# EAGLE design controller11lcd (EAGLE 8.3.1)

## Sheet 1 of 2
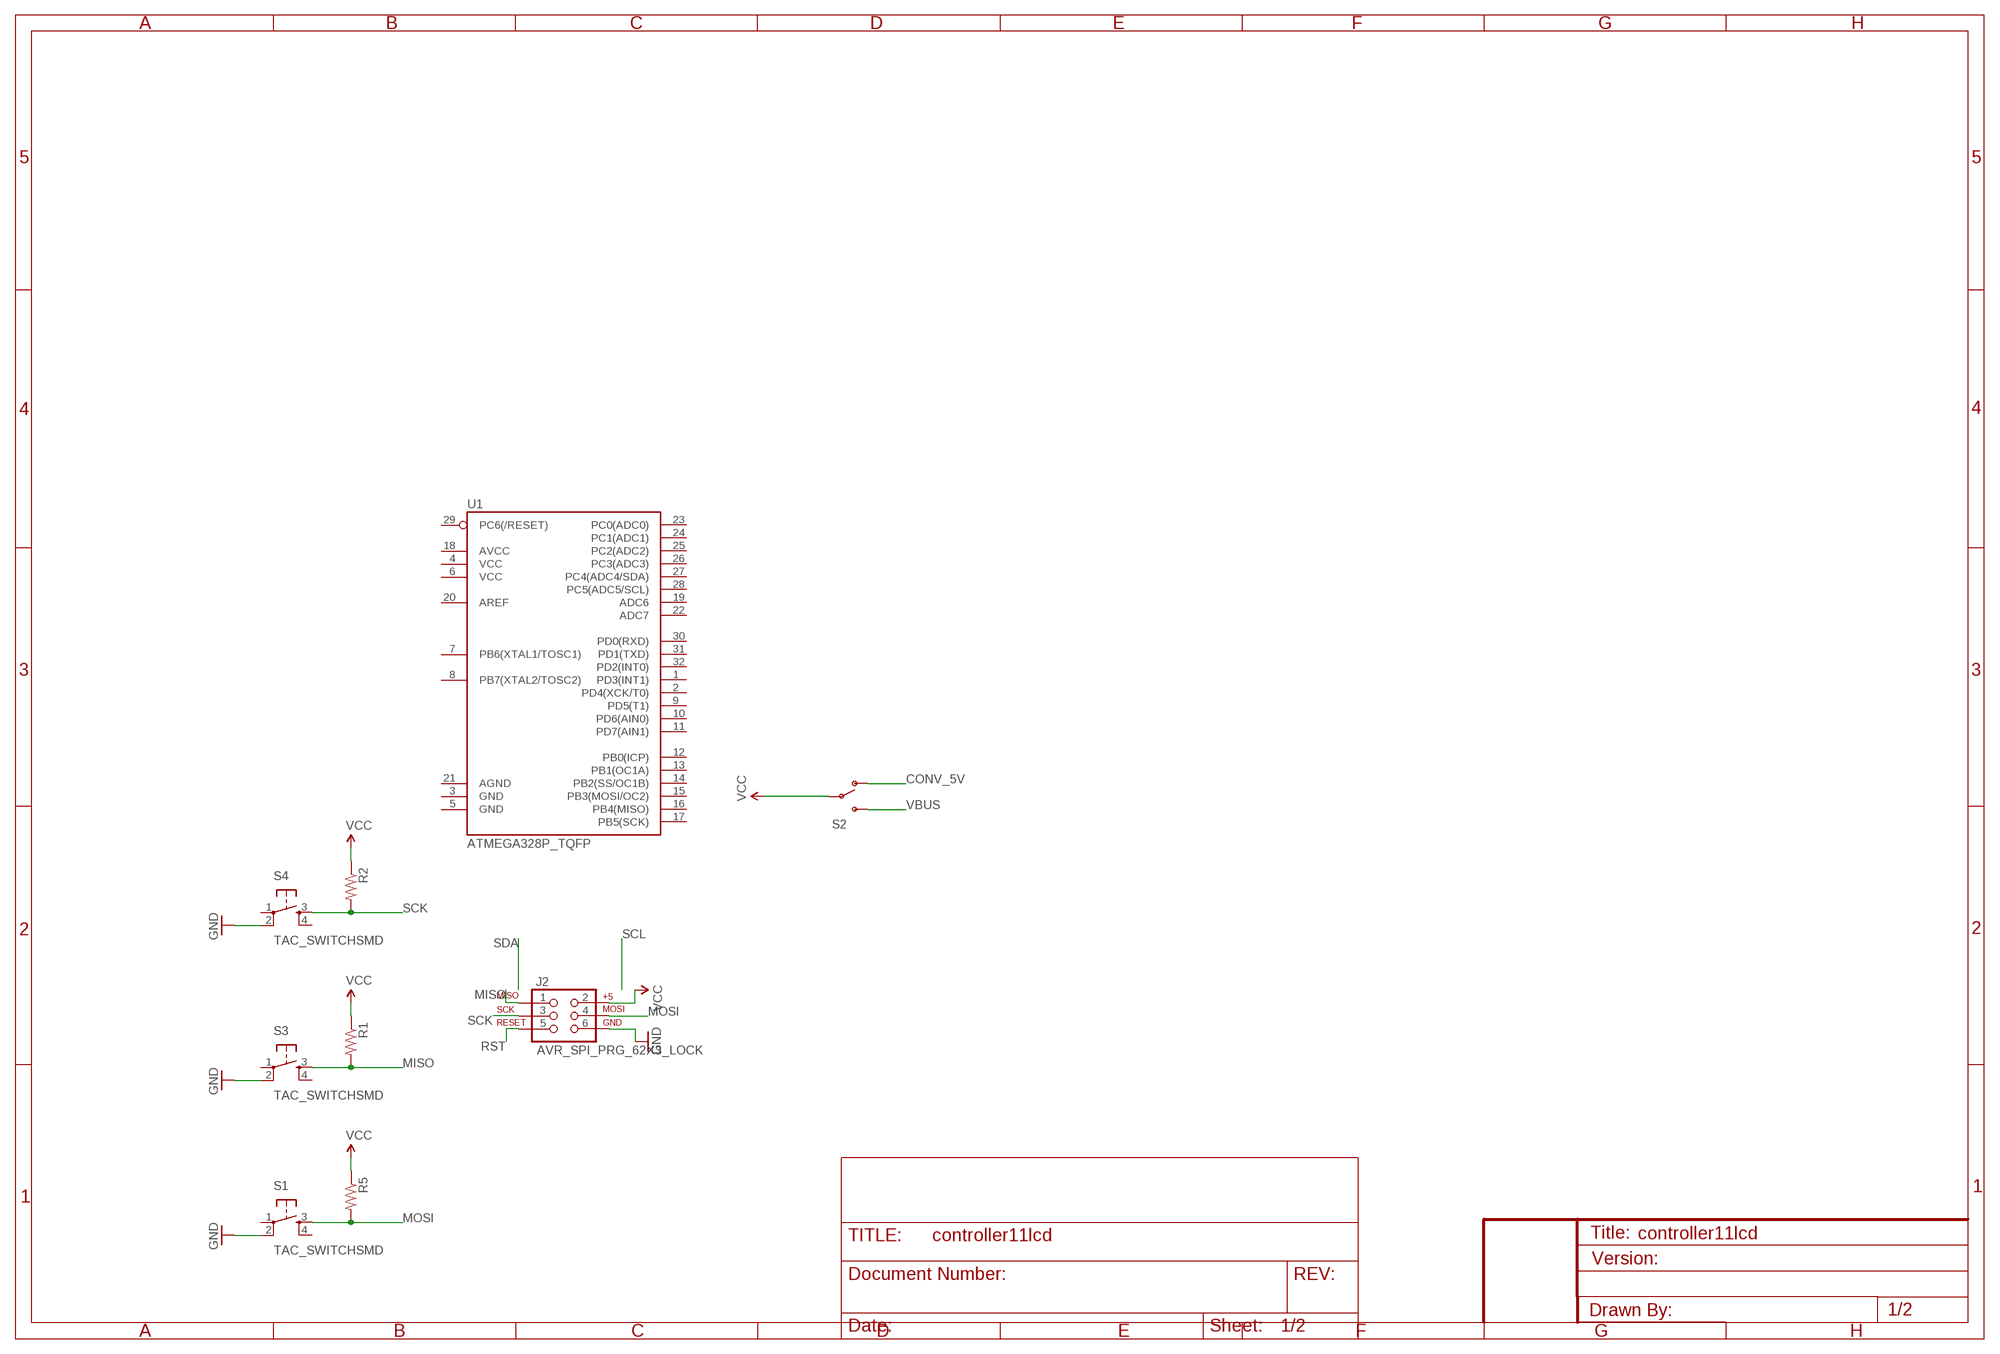
[diagram p0: schematic, sheet 1]

### Parts
J2  AVR_SPI_PRG_62X3_LOCK  [2X3_LOCK]
R1  RESISTOR1206  [1206]
R2  RESISTOR1206  [1206]
R5  RESISTOR1206  [1206]
S1  TAC_SWITCHSMD  TAC_SWITCHPTH  [TACTILE-PTH]
S2  SWITCH-SPDTSMD2  [SWITCH-SPDT-SMD]
S3  TAC_SWITCHSMD  TAC_SWITCHPTH  [TACTILE-PTH]
S4  TAC_SWITCHSMD  TAC_SWITCHPTH  [TACTILE-PTH]
U1  ATMEGA328P_TQFP  [TQFP32-08]

### Nets
CONV_5V [power]: S2.1(O)
GND: J2.6 S1.2 S3.2 S4.2
MISO: J2.1 R1.2 S3.3
MOSI: J2.4 R5.2 S1.3
RST: J2.5
SCK: J2.3 R2.2 S4.3
VBUS: S2.3(S)
VCC [power]: J2.2 R1.1 R2.1 R5.1 S2.2(P)
Unconnected: S1.1 S1.4 S3.1 S3.4 S4.1 S4.4 U1.1(PD3(INT1)) U1.2(PD4(XCK/T0)) U1.3(GND) U1.4(VCC) U1.5(GND) U1.6(VCC) U1.7(PB6(XTAL1/TOSC1)) U1.8(PB7(XTAL2/TOSC2)) U1.9(PD5(T1)) U1.10(PD6(AIN0)) U1.11(PD7(AIN1)) U1.12(PB0(ICP)) U1.13(PB1(OC1A)) U1.14(PB2(SS/OC1B)) U1.15(PB3(MOSI/OC2)) U1.16(PB4(MISO)) U1.17(PB5(SCK)) U1.18(AVCC) U1.19(ADC6) U1.20(AREF) U1.21(AGND) U1.22(ADC7) U1.23(PC0(ADC0)) U1.24(PC1(ADC1)) U1.25(PC2(ADC2)) U1.26(PC3(ADC3)) U1.27(PC4(ADC4/SDA)) U1.28(PC5(ADC5/SCL)) U1.29(PC6(/RESET)) U1.30(PD0(RXD)) U1.31(PD1(TXD)) U1.32(PD2(INT0))

## Sheet 2 of 2
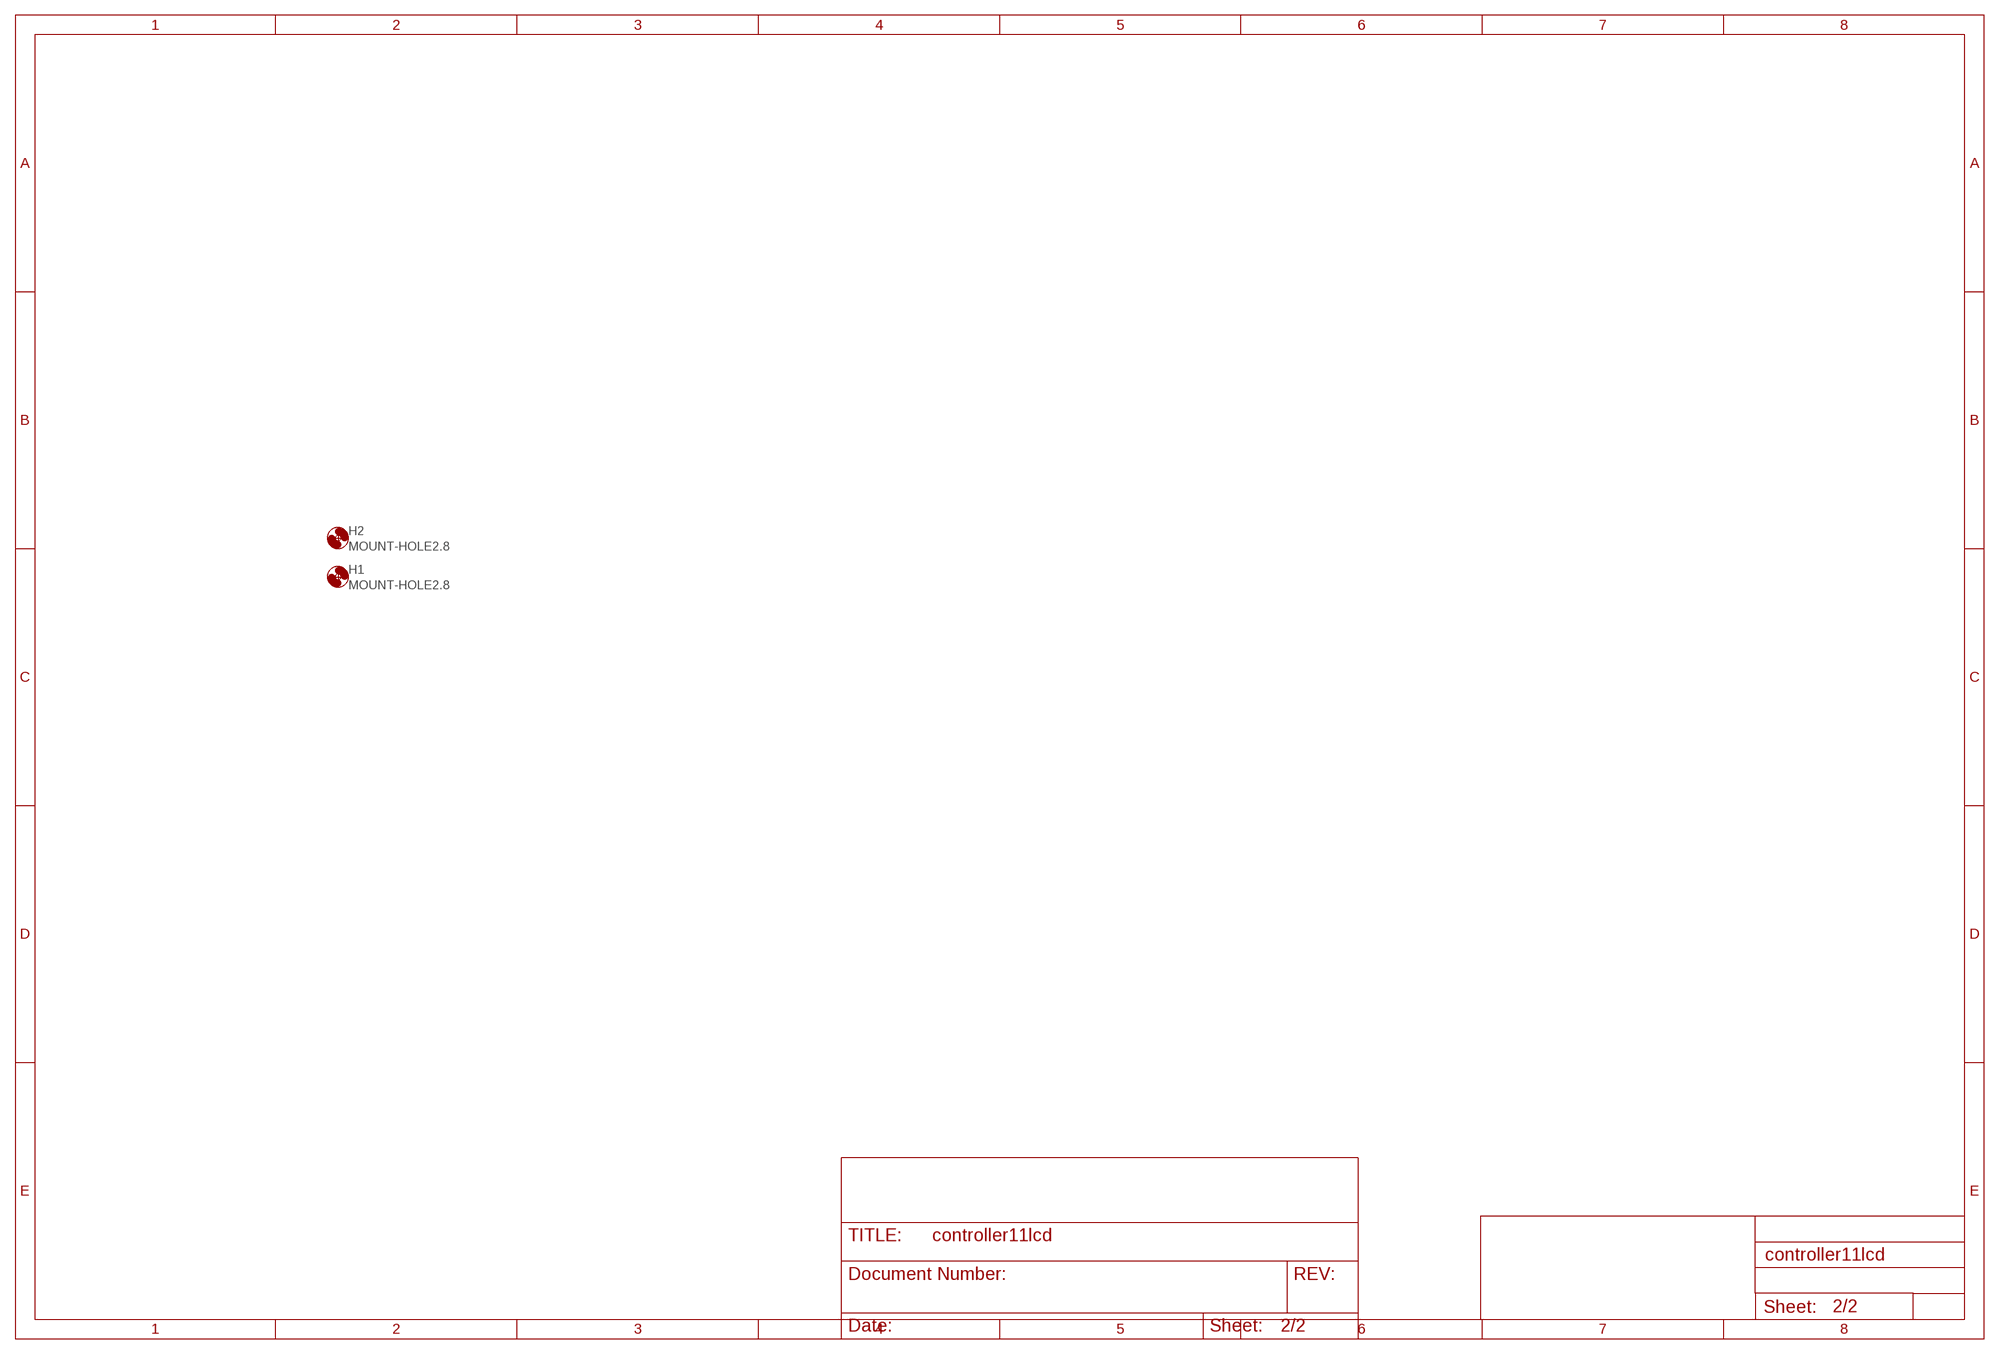
[diagram p1: schematic, sheet 2]

### Parts
H1  MOUNT-HOLE2.8  [2,8]
H2  MOUNT-HOLE2.8  [2,8]

## Library data of the parts
H1 H2 = holes:MOUNT-HOLE: MOUNTING HOLE with drill center marker
J2 = SparkFun-Connectors:AVR_SPI_PRG_6: AVR ISP 6 Pin This is the reduced ISP connector for AVR programming. Common on Arduino. This footprint will take up less PCB space and can be used with a 10-pin to 6-pin adapter such as SKU: BOB-08508 **Special note about "TEST_POINT" package. The stop mask is on the top side, so if you want your programming test points to be on the bottom of your board, make sure to place this package on the bottom side of the board. This also ensure that the orientation to program from the bottom side will be correct.
R1 R2 R5 = SparkFun-Passives:RESISTOR: Resistor Basic schematic elements and footprints for 0603, 1206, and PTH resistors.
S1 S3 S4 = SparkFun-Retired:TAC_SWITCH: Momentary Switch Button commonly used for reset or general input. Spark Fun Electronics SKU : COM-00097 SMT- SWCH-08247
S2 = SparkFun-Electromechanical:SWITCH-SPDT: SPDT Switch Simple slide switch, Spark Fun Electronics SKU : COM-00102 DPDT SMT slide switch, AYZ0202, SWCH-08179
U1 = SparkFun-DigitalIC:ATMEGA328P_TQFP; PROD_ID: IC-09069

## Net classes
0 default: width 0.254 mm, clearance 0.254 mm
1 power: width 0.381 mm, clearance 0.254 mm
2 camera_power: width 0.66 mm, clearance 0.254 mm
3 usbsignal: width 0.254 mm, clearance 0.203 mm

## Board
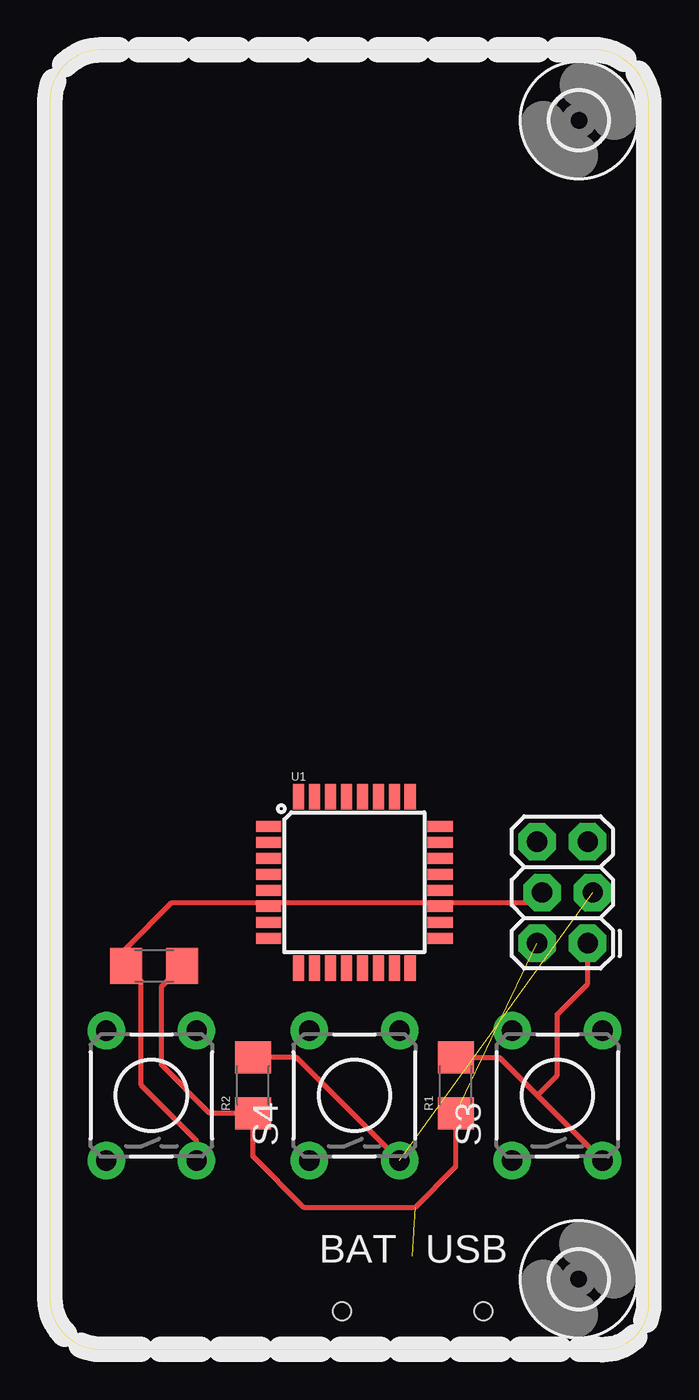
[diagram p2: board, top side]
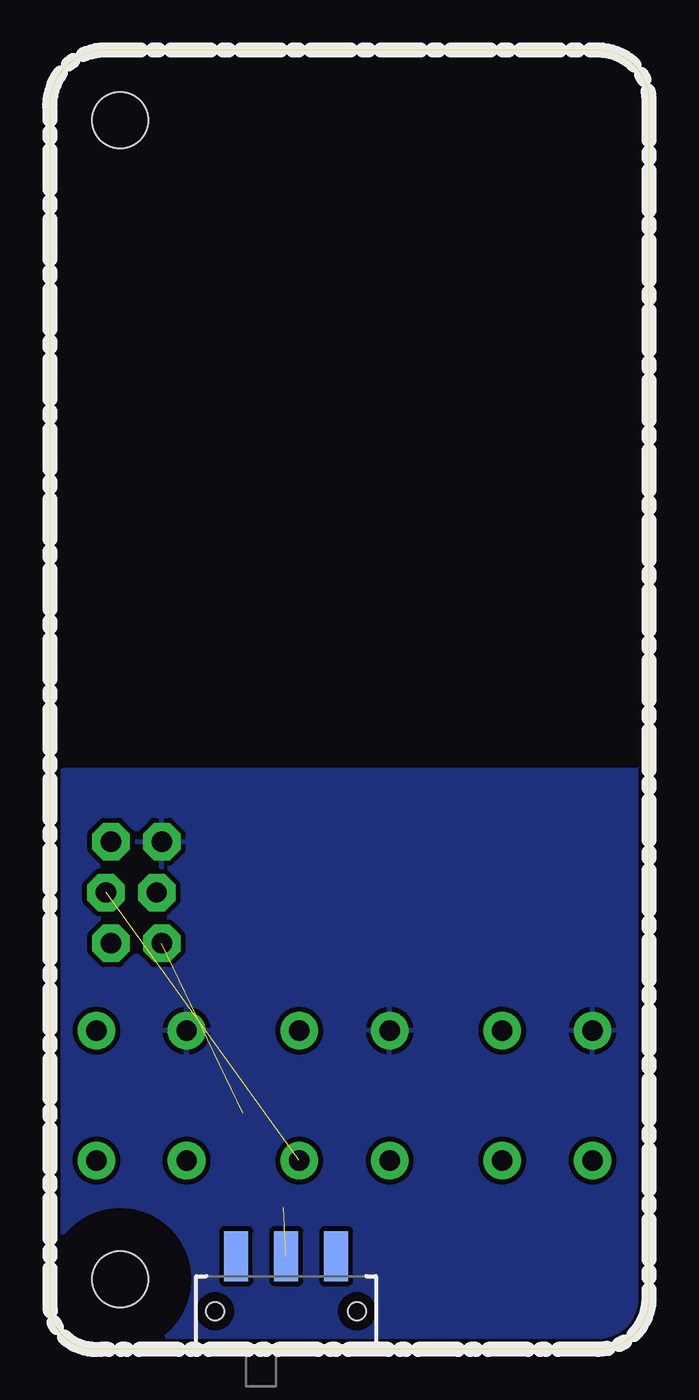
[diagram p3: board, bottom side, seen from below]

Size 29.98 x 65.04 mm. Coordinates in mm from the lower left corner, seen from the top.
Outline: 0,2.55 arc90 2.54,0.01 27.43,0.01 arc90 29.97,2.05 29.97,61.99 arc90 27.43,65.04 2.54,65.04 arc90 0,62.5 0,2.55
Copper layers (1*16): Top 0.035mm / dielectric 1.5mm / Bottom 0.035mm
Design rules "default *": minimum track width 10mil, minimum drill 24mil, track to track 8mil, track to pad 8mil, pad to pad 8mil, via to via 8mil, smd to smd 8mil, copper to edge 20mil, drill to drill 8mil, minimum pad ring 10mil, minimum via ring 8mil, stop-mask expansion 4mil, vias tented up to drill 0mil, thermal gap 10mil

### Footprints (pad centres in the part's own frame; a part is rotated, then mirrored left to right if it is on the bottom)
2,8 = hole 2.8: 0,0
2X3_LOCK = drill 1.016 pad 1.88 octagon: 1 0,0; 2 0,2.54; 3 2.54,-0.254; 4 2.54,2.286; 5 5.08,0; 6 5.08,2.54
1206 = smd 1.6 x 1.8: 1 -1.4,0; 2 1.4,0
TACTILE-PTH = drill 1.016 pad 1.88: 1 -3.251,2.261; 2 3.251,2.261; 3 -3.251,-2.261; 4 3.251,-2.261
SWITCH-SPDT-SMD = smd 1.2 x 2.5: 1 -2.5,-2.75; 2 0,-2.75; 3 2.5,-2.75 | hole 0.9: -3.55,0; 3.55,0
TQFP32-08 = smd 1.27 x 0.559: 1 -4.293,2.8; 2 -4.293,2; 3 -4.293,1.2; 4 -4.293,0.4; 5 -4.293,-0.4; 6 -4.293,-1.2; 7 -4.293,-2; 8 -4.293,-2.8; 17 4.293,-2.8; 18 4.293,-2; 19 4.293,-1.2; 20 4.293,-0.4; 21 4.293,0.4; 22 4.293,1.2; 23 4.293,2; 24 4.293,2.8 | smd 0.559 x 1.27: 9 -2.8,-4.293; 10 -2,-4.293; 11 -1.2,-4.293; 12 -0.4,-4.293; 13 0.4,-4.293; 14 1.2,-4.293; 15 2,-4.293; 16 2.8,-4.293; 25 2.8,4.293; 26 2,4.293; 27 1.2,4.293; 28 0.4,4.293; 29 -0.4,4.293; 30 -1.2,4.293; 31 -2,4.293; 32 -2.8,4.293

### Placement (x,y rotation side)
H1  26.47,3.52 0 top
H2  26.48,61.52 0 top
J2  26.92,20.33 90 top
R1  20.32,13.22 90 top
R2  10.16,13.22 90 top
R5  5.21,19.19 180 top
S1  5.08,12.71 90 top
S2  18.16,1.92 180 bottom
S3  25.4,12.71 90 top
S4  15.24,12.71 90 top
U1  15.24,23.38 0 top

### Tracks (layer width: path | path; a pad name or v marks a point on that pad's centre or on a via)
GND
  pour Bottom: 29.84,0.01 0,0.01 -0.51,28.97 29.34,28.97
MISO
  Top 0.254: R1.2 22.5,14.62 24.4,12.73 | 24.4,12.73 S3.3 | 24.4,12.73 25.4,13.73 25.4,16.78 26.92,18.3 J2.1
MOSI
  Top 0.254: S1.3 7.34,10.45 4.57,13.22 4.57,18.43 R5.2 3.81,20.08 6.1,22.37 24.13,22.37 J2.4
SCK  (1 unrouted)
  Top 0.254: S4.3 12.34,14.62 R2.2
VCC  (2 unrouted)
  Top 0.254: R1.1 20.32,9.16 18.29,7.13 12.7,7.13 10.16,9.67 R2.1 8,11.82 5.59,14.24 5.59,18.17 R5.1

### Text on the board
tPlace: OUT | BAT | USB